# Altium schematic sheet P2.schdoc
size 420 x 298 mm; Symbol: Sheet-Symbol_A3; Company: 嘉立创EDA; Version: V1.0; Page Size: A3; @Project Name: ESP32S3_DMX_RDM_2026-06-09; @Page Count: 2; @Update Date: 2026-08-19; @Create Date: 2026-08-19; @Schematic Name: Schematic_BAT; @Page No: 2; @Page Name: P2; Device: Sheet-Symbol_A3
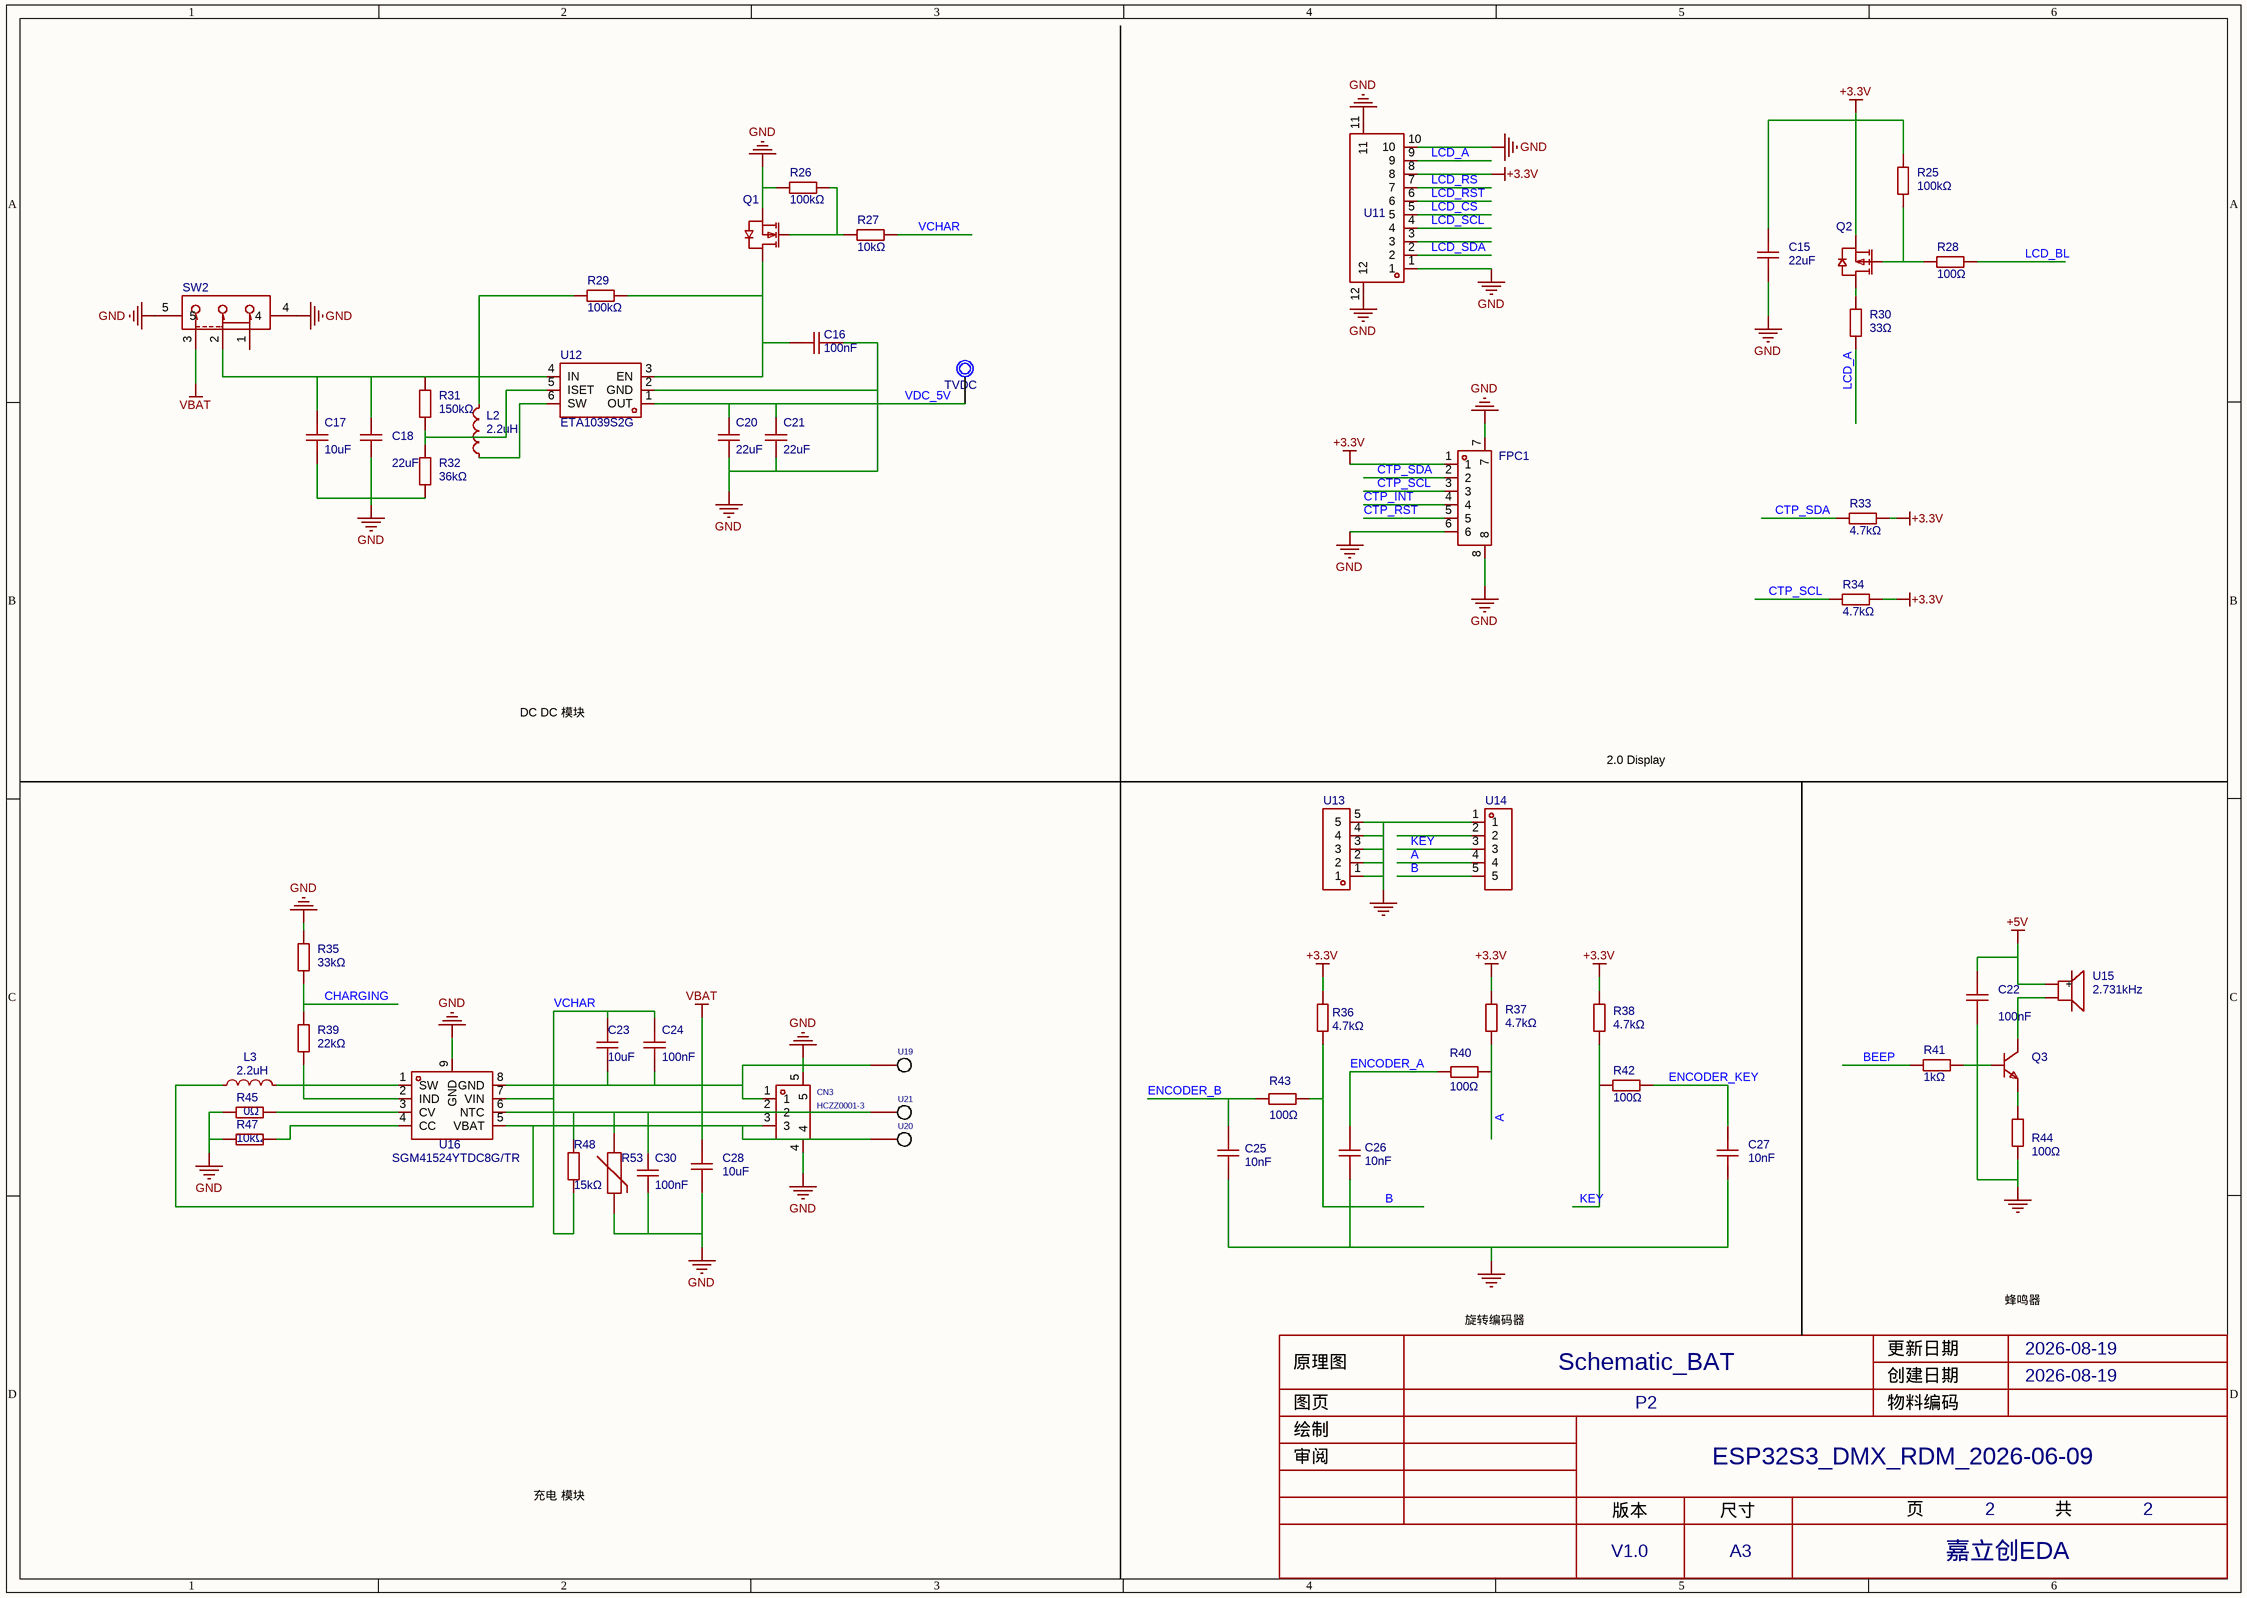
[diagram p0: P2.schdoc]

## Parts
C15  22uF  [C0805]
C16  100nF  [C0805]
C17  10uF  [C0805]
C18  22uF  [C0805]
C20  22uF  [C0805]
C21  22uF  [C0805]
C22  100nF  [C0805]
C23  10uF  [C0805]
C24  100nF  [C0805]
C25  10nF  [C0805]
C26  10nF  [C0805]
C27  10nF  [C0805]
C28  10uF  [C0805]
C30  100nF  [C0603]
CN3  HCZZ0001-3  [CONN-SMD_3P-P1.25_HCZZ0001-3]
FPC1  05B20L06P  [FPC-SMD_6P-P0.50_05B20L06P]  (value not drawn)
L2  2.2uH  [IND-SMD_L4.0-W4.0]
L3  2.2uH  [IND-SMD_L4.0-W4.0]
Q1  NTR4503NT1G  [SOT-23-3_L2.9-W1.3-P1.90-LS2.4-BR]  (value not drawn)
Q2  AO3401A  [SOT-23-3_L2.9-W1.3-P1.90-LS2.4-BR]  (value not drawn)
Q3  S8050  [SOT-23-3_L2.9-W1.3-P1.90-LS2.4-BR]  (value not drawn)
R25  100kΩ  [R0805]
R26  100kΩ  [R0805]
R27  10kΩ  [R0805]
R28  100Ω  [R0805]
R29  100kΩ  [R0805]
R30  33Ω  [R0805]
R31  150kΩ  [R0805]
R32  36kΩ  [R0805]
R33  4.7kΩ  [R0805]
R34  4.7kΩ  [R0805]
R35  33kΩ  [R0805]
R36  4.7kΩ  [R0805]
R37  4.7kΩ  [R0805]
R38  4.7kΩ  [R0805]
R39  22kΩ  [R0805]
R40  100Ω  [R0805]
R41  1kΩ  [R0805]
R42  100Ω  [R0805]
R43  100Ω  [R0805]
R44  100Ω  [R0805]
R45  0Ω  [R0805]
R47  10kΩ  [R0805]
R48  15kΩ  [R0805]
R53  SDNT1608X103F3950FTF  [R0603]  (value not drawn)
SW2  SK-12D02-G030  [SW-TH_SK-12D02VG3]  (value not drawn)
TVDC  (no value)  [测试点]
U11  HC-FPC-0.5-10P-CSH20  [FPC-SMD_10P-P0.50_HC-FPC-0.5-10P-CSH20]  (value not drawn)
U12  ETA1039S2G  [SOT-23-6_L2.9-W1.6-P0.95-LS2.8-BR]
U13  2541WV-05P  [HDR-TH_5P-P2.54-V-M]  (value not drawn)
U14  2541WV-05P  [HDR-TH_5P-P2.54-V-M]  (value not drawn)
U15  2.731kHz  [BUZ-SMD_4P-L8.5-W8.5-P8.50-TL-A]
U16  SGM41524YTDC8G/TR  [DFN-8_L3.0-W2.0-P0.50-TL-EP-1]
U19  电池焊盘  [电池焊盘]  (value not drawn)
U20  电池焊盘  [电池焊盘]  (value not drawn)
U21  电池焊盘  [电池焊盘]  (value not drawn)

## Nets
+3.3V: C15.2 FPC1.1 Q2.2(S) R25.2 R33.2 R34.2 R36.2 R37.2 R38.2 U11.8
+5V: C22.2 U15.1(+)
GND: C15.1 C16.1 C17.2 C18.2 C20.2 C21.2 C22.1 C23.2 C24.1 C25.1 C26.1 C27.1 C28.2 C30.1 CN3.1 CN3.4 CN3.5 FPC1.6 FPC1.7 FPC1.8 Q1.2(S) R26.2 R32.1 R35.2 R44.1 R45.2 R47.2 R53.1 SW2.4 SW2.5 U11.1 U11.10 U11.11 U11.12 U12.2(GND) U13.1 U13.2 U13.3 U13.4 U13.5 U14.1 U16.8(GND) U16.9(GND) U19.1
VBAT: C28.1 CN3.3 L3.1 SW2.3 U16.5(VBAT) U20.1
A: R37.1 R40.2 U14.4
B: R36.1 R43.2 U14.5
BEEP: R41.1
CHARGING: R35.1 R39.2
CTP_INT: FPC1.4
CTP_RST: FPC1.5
CTP_SCL: FPC1.3 R34.1
CTP_SDA: FPC1.2 R33.1
ENCODER_A: C26.2 R40.1
ENCODER_B: C25.2 R43.1
ENCODER_KEY: C27.2 R42.2
KEY: R38.1 R42.1 U14.3
LCD_A: R30.1 U11.9
LCD_BL: R28.1
LCD_CS: U11.5
LCD_RS: U11.7
LCD_RST: U11.6
LCD_SCL: U11.4
LCD_SDA: U11.2
VCHAR: C23.1 C24.2 R27.1 R48.1 U16.7(VIN)
VDC_5V: C20.1 C21.1 TVDC.1 U12.1(OUT)
NetC16_2: C16.2 Q1.3(D) R29.2 U12.3(EN)
NetC17_1: C17.1 C18.1 L2.2 R29.1 R31.2 SW2.2 U12.4(IN)
NetC30_2: C30.2 CN3.2 R48.2 R53.2 U16.6(NTC) U21.1
NetL2_1: L2.1 U12.6(SW)
NetL3_2: L3.2 U16.1(SW)
NetQ1_1: Q1.1(G) R26.1 R27.2
NetQ2_1: Q2.1(G) R25.1 R28.2
NetQ2_3: Q2.3(D) R30.2
NetQ3_1: Q3.1(B) R41.2
NetQ3_2: Q3.2(E) R44.2
NetQ3_3: Q3.3(C) U15.2
NetR31_1: R31.1 R32.2 U12.5(ISET)
NetR39_1: R39.1 U16.2(IND)
NetR45_1: R45.1 U16.3(CV)
NetR47_1: R47.1 U16.4(CC)

Not connected (* = marked no-connect by the designer): SW2 1; U11 3; U14 2; U15 3 4

## Notes on the sheet
- DC DC 模块
- 2.0 Display
- 旋转编码器
- 蜂鸣器
- 充电 模块
- 更新日期
- 2026-08-19
- 原理图
- 图页
- Schematic_BAT
- P2
- 创建日期
- 物料编码
- 审阅
- 绘制
- ESP32S3_DMX_RDM_2026-06-09
- 版本
- V1.0
- 尺寸
- A3
- 页
- 2
- 嘉立创EDA
- 共

## Library data of the parts
C15 = GRM21BR61A226ME51K: Manufacturer: muRata(村田); Add into BOM: yes; 3D Model: 1ba041120af144c991958decab20d2410819f05c4eef4c71ace90d822a990e87; 3D Model Transform: 78.74,51.181,0,0,0,0,0,0.0005,0; ModelName: C0805_L2.0-W1.3-H1.3; Symbol: GRM21BR61A226ME51K; Device: GRM21BR61A226ME51K; Convert to PCB: yes; Manufacturer Part: GRM21BR61A226ME51K; Supplier: LCSC; Supplier Part: GRM21BR61A226ME51K.1; Value: 22uF; FootprintName: C0805
C16 C22 C24 = CC0805KRX7R9BB104: 容值:100nF;精度:±10%;额定电压:50V;温度系数:X7R;; Manufacturer: YAGEO(国巨); Add into BOM: yes; Tolerance: ±10%; Voltage Rating: 50V; Temperature Coefficient: X7R; 3D Model: 1ba041120af144c991958decab20d241; 3D Model Transform: 78.74,51.181,0,0,0,0,0,0.0005,0; ModelName: C0805_L2.0-W1.3-H1.3; Symbol: CC0805KRX7R9BB104; Device: CC0805KRX7R9BB104; Convert to PCB: yes; LCSC Part Name: 100nF ±10% 50V; Supplier Part: C49678; Manufacturer Part: CC0805KRX7R9BB104; Supplier Footprint: 0805; JLCPCB Part Class: Basic Part; Datasheet: https://item.szlcsc.com/datasheet/CC0805KRX7R9BB104/50686.html; Supplier: LCSC; Value: 100nF; FootprintName: C0805
C17 C23 C28 = GRM21BR61H106KE43L: 容值:10uF;精度:±10%;额定电压:50V;温度系数:X5R;; Manufacturer: muRata(村田); 3D Model: 1ba041120af144c991958decab20d2410819f05c4eef4c71ace90d822a990e87; 3D Model Transform: 78.74,51.181,0,0,0,0,0,0.0005,0; Tolerance: ±10%; Voltage Rating: 50V; Temperature Coefficient: X5R; AddInBom: yes; ModelName: C0805_L2.0-W1.3-H1.3; Symbol: GRM21BR61H106KE43L; Device: GRM21BR61H106KE43L; LCSC Part Name: 10uF ±10% 50V; Supplier Part: C440198; Manufacturer Part: GRM21BR61H106KE43L; Supplier Footprint: 0805; JLCPCB Part Class: Basic Part; Datasheet: https://item.szlcsc.com/datasheet/GRM21BR61H106KE43L/439567.html; Supplier: LCSC; Value: 10uF; ConvertToPcb: yes; FootprintName: C0805
C18 = GRM21BR61E226ME44L: 容值:22uF;精度:±20%;额定电压:25V;温度系数:X5R;; Manufacturer: muRata(村田); Add into BOM: yes; Tolerance: ±20%; Voltage Rating: 25V; Temperature Coefficient: X5R; 3D Model: 1ba041120af144c991958decab20d241; 3D Model Transform: 78.74,51.181,0,0,0,0,0,0.0005,0; ModelName: C0805_L2.0-W1.3-H1.3; Symbol: GRM21BR61E226ME44L; Device: GRM21BR61E226ME44L; Convert to PCB: yes; LCSC Part Name: 22uF ±20% 25V; Supplier Part: C86816; Manufacturer Part: GRM21BR61E226ME44L; Supplier Footprint: 0805; JLCPCB Part Class: Extended Part; Datasheet: https://item.szlcsc.com/datasheet/GRM21BR61E226ME44L/87993.html; Supplier: LCSC; Value: 22uF; FootprintName: C0805
C20 C21 = GRM21BR61E226ME44L: 容值:22uF;精度:±20%;额定电压:25V;温度系数:X5R;; Manufacturer: muRata(村田); Add into BOM: yes; Tolerance: ±20%; Voltage Rating: 25V; Temperature Coefficient: X5R; 3D Model: 1ba041120af144c991958decab20d2410819f05c4eef4c71ace90d822a990e87; 3D Model Transform: 78.74,51.181,0,0,0,0,0,0.0005,0; ModelName: C0805_L2.0-W1.3-H1.3; Symbol: GRM21BR61E226ME44L; Device: GRM21BR61E226ME44L; Convert to PCB: yes; LCSC Part Name: 22uF ±20% 25V; Supplier Part: C86816; Manufacturer Part: GRM21BR61E226ME44L; Supplier Footprint: 0805; JLCPCB Part Class: Extended Part; Datasheet: https://item.szlcsc.com/datasheet/GRM21BR61E226ME44L/87993.html; Supplier: LCSC; Value: 22uF; FootprintName: C0805
C25-C27 = CC0805MRX7R9BB103: 容值:10nF;精度:±20%;额定电压:50V;温度系数:X7R;; Manufacturer: YAGEO(国巨); Add into BOM: yes; 3D Model: 1ba041120af144c991958decab20d241; 3D Model Transform: 78.74,51.181,0,0,0,0,0,0.0005,0; Tolerance: ±20%; Temperature Coefficient: X7R; Voltage Rating: 50V; ModelName: C0805_L2.0-W1.3-H1.3; Symbol: CC0805MRX7R9BB103; Device: CC0805MRX7R9BB103; Convert to PCB: yes; LCSC Part Name: 10nF ±20% 50V; Supplier Part: C2169410; Manufacturer Part: CC0805MRX7R9BB103; Supplier Footprint: 0805; JLCPCB Part Class: Extended Part; Datasheet: https://item.szlcsc.com/datasheet/CC0805MRX7R9BB103/2261475.html; Supplier: LCSC; Value: 10nF; FootprintName: C0805
C30 = CL10B104KO8NNNC: 容值:100nF;精度:±10%;额定电压:16V;温度系数:X7R;; Manufacturer: SAMSUNG(三星); AddInBom: yes; ModelId: ac125912035d415993ca9572d50418b10819f05c4eef4c71ace90d822a990e87; ModelName: C0603_L1.6-W0.8-H0.8; ModelTransform: 62.992,31.496,0,0,0,0,0,0,0; Tolerance: ±10%; Voltage Rating: 16V; Temperature Coefficient: X7R; Symbol: CL10B104KO8NNNC; Device: CL10B104KO8NNNC; LCSC Part Name: 100nF ±10% 16V; SupplierPart: C66501; ManufacturerPart: CL10B104KO8NNNC; Supplier Footprint: 0603; JLCPCB Part Class: Extended Part; Datasheet: https://item.szlcsc.com/datasheet/CL10B104KO8NNNC/67585.html; Supplier: LCSC; ConvertToPcb: yes; FootprintName: C0603; Value: 100nF
CN3 = HCZZ0001-3: 插针结构:1x3P;间距:1.25mm;安装方式:卧贴;参考系列:PicoBlade(MX 1.25);总PIN数:3P;排数:1;每排PIN数:3;行距:-;额定电流:1A;触头材质:铜;触头镀层:锡;工作温度:-25℃~+70℃;; Manufacturer: HC(虹成电子); Add into BOM: yes; Pins Structure: 1x3P; Pitch: 1.25mm; Number of PINs Per Row: 3; Current Rating: 1A; Voltage Rating: 125V; Plastic Material: LCP; Z-Height of the Board: 3.6mm; X-Length of Bottom Edge on Board (Spacing Line): 8.85mm; Y-Width of Bottom Edge on Board: 5.4mm; 3D Model: c6a9bdedfd694ef4ab9e0380057e79cd; 3D Model Transform: 348.8182,212.598,0,0,0,0,0,-39.685,0; Symbol: HCZZ0001-3; Device: HCZZ0001-3; Convert to PCB: yes; LCSC Part Name: 米色 1x3P 间距:1.25mm 卧贴 系列:PicoBlade(MX 1.25); Supplier Part: C7433454; Manufacturer Part: HCZZ0001-3; Supplier Footprint: SMD,P=1.25mm,卧贴; JLCPCB Part Class: Extended Part; Datasheet: https://item.szlcsc.com/datasheet/HCZZ0001-3/8442479.html; Supplier: LCSC; Mounting Type: 卧贴; Reference Series: PicoBlade(MX 1.25); Number of Pins: 3P; Number of Rows: 1; Row Spacing: -; Contact Material: 铜; Contact Plating: 锡; Operating Temperature: -25℃~+70℃; Flame Retardant Rating: -; Color: 米色; Supplementary Features: -; FootprintName: CONN-SMD_3P-P1.25_HCZZ0001-3; ModelName: CONN-SMD_3P-P1.25_HCZZ0001-3
FPC1 = 05B20L06P: 锁定特性:抽屉式;触点类型:下接;触点数量:6P;间距:0.5mm;; Manufacturer: HanElectricity(瀚源); 3D Model: 3af2045d771d4a89add03d0759047a010819f05c4eef4c71ace90d822a990e87; 3D Model Transform: 337.4009,204.724,0,180,0,0,-0.002,47.68,0; Locking Feature: 抽屉式; Number of Contacts: 6P; Pitch: 0.5mm; AddInBom: yes; Symbol: 05B20L06P; Device: 05B20L06P; LCSC Part Name: 抽屉式 下接 P数:6P 间距:0.5mm; Supplier Part: C22435651; Manufacturer Part: 05B20L06P; Supplier Footprint: SMD,P=0.5mm,卧贴; JLCPCB Part Class: Extended Part; Datasheet: https://item.szlcsc.com/datasheet/05B20L06P/24065925.html; Supplier: LCSC; Contact Type: 下接; Height Above Board: 2mm; Contact Plating: 锡; ConvertToPcb: yes; FootprintName: FPC-SMD_6P-P0.50_05B20L06P; ModelName: FPC-SMD_6P-P0.50_05B20L06P
L2 = SWPA4030S2R2NT: 电感值:2.2uH;精度:±30%;额定电流:2.95A;饱和电流(Isat):5.8A;类型:-;; Manufacturer: Sunlord(顺络); AddInBom: yes; ModelId: 45bc3737ecfd4f3bb122605ee525b0180819f05c4eef4c71ace90d822a990e87; ModelName: IND-SMD_L4.0-W4.0-H1.9; ModelTransform: 157.48,157.484,0,0,0,0,0,0,0; Tolerance: ±30%; Current Rating: 2.95A; Current - Saturation(Isat): 5.8A; DC Resistance(DCR): 30mΩ; Symbol: SWPA4030S2R2NT; Device: SWPA4030S2R2NT; LCSC Part Name: 2.2uH ±30% 5.8A; SupplierPart: C279948; ManufacturerPart: SWPA4030S2R2NT; Supplier Footprint: SMD,4x4mm; JLCPCB Part Class: Extended Part; Datasheet: https://item.szlcsc.com/datasheet/SWPA4030S2R2NT/266524.html; Supplier: LCSC; ConvertToPcb: yes; FootprintName: IND-SMD_L4.0-W4.0; Value: 2.2uH; Type: -; Ratings: -
L3 = WPN4020H2R2MT: 电感值:2.2uH;精度:±20%;额定电流:4.3A;饱和电流(Isat):7.6A;类型:-;; Manufacturer: Sunlord(顺络); AddInBom: yes; ModelId: 45bc3737ecfd4f3bb122605ee525b0180819f05c4eef4c71ace90d822a990e87; ModelName: IND-SMD_L4.0-W4.0-H1.9; ModelTransform: 157.48,157.484,0,0,0,0,0,0,0; Tolerance: ±20%; Current Rating: 4.3A; Current - Saturation(Isat): 7.6A; DC Resistance(DCR): 48mΩ; Symbol: WPN4020H2R2MT; Device: WPN4020H2R2MT; LCSC Part Name: 2.2uH ±20% 7.6A; SupplierPart: C98361; ManufacturerPart: WPN4020H2R2MT; Supplier Footprint: SMD,4x4mm; JLCPCB Part Class: Extended Part; Datasheet: https://item.szlcsc.com/datasheet/WPN4020H2R2MT/99570.html; Supplier: LCSC; ConvertToPcb: yes; FootprintName: IND-SMD_L4.0-W4.0; Value: 2.2uH; Type: -; Ratings: -
Q1 = NTR4503NT1G_C19829404: 漏源电压(Vdss):30V;连续漏极电流(Id):3A;导通电阻(RDS(on)):95mΩ@4.5V;耗散功率(Pd):900mW;阈值电压(Vgs(th)):3V@250uA;; Manufacturer: TECH PUBLIC(台舟); 3D Model: c62791f0466c4ae2a892c056b845b0ca0819f05c4eef4c71ace90d822a990e87; 3D Model Transform: 98.425,114.173,0,180,0,0,0.0005,-0.0005,0; Drain to Source Voltage: 30V; Current - Continuous Drain(Id): 3A; Pd - Power Dissipation: 900mW; Gate Charge(Qg): 10nC@10V; Input Capacitance(Ciss): 235pF; Reverse Transfer Capacitance (Crss@Vds): 18pF; Output Capacitance(Coss): 35pF; AddInBom: yes; ModelName: SOT-23-3P_L2.9-W1.3-H1.0-LS2.4-P0.95; Symbol: NTR4503NT1G_C19829404; Device: NTR4503NT1G_C19829404; LCSC Part Name: 耐压:30V 电流:3A; Supplier Part: C19829404; Manufacturer Part: NTR4503NT1G; Supplier Footprint: SOT-23; JLCPCB Part Class: Extended Part; Datasheet: https://item.szlcsc.com/datasheet/NTR4503NT1G/21156699.html; Supplier: LCSC; RDS(on): 95mΩ@4.5V; Gate Threshold Voltage (Vgs(th)): 3V@250uA; Operating Temperature: -55℃~+150℃; ConvertToPcb: yes; FootprintName: SOT-23-3_L2.9-W1.3-P1.90-LS2.4-BR
Q2 = AO3401A: 漏源电压(Vdss):30V;连续漏极电流(Id):4.2A;导通电阻(RDS(on)):55mΩ@10V,4.2A;耗散功率(Pd):1.2W;阈值电压(Vgs(th)):-;; Manufacturer: TECH PUBLIC(台舟); Symbol: AO3401A_C5122001; Add into BOM: yes; 3D Model: c62791f0466c4ae2a892c056b845b0ca; 3D Model Transform: 98.425,114.173,0,180,0,0,0.0005,-0.0005,0; Drain to Source Voltage: 30V; Pd - Power Dissipation: 1.2W; Gate Charge(Qg): 8.5nC; Input Capacitance(Ciss): 880pF@15V; Reverse Transfer Capacitance (Crss@Vds): 65pF@15V; ModelName: SOT-23-3P_L2.9-W1.3-H1.0-LS2.4-P0.95; Device: AO3401A; Convert to PCB: yes; LCSC Part Name: 耐压:30V 电流:4.2A; Supplier Part: C5122001; Manufacturer Part: AO3401A; Supplier Footprint: SOT-23; JLCPCB Part Class: Extended Part; Datasheet: https://item.szlcsc.com/datasheet/AO3401A/5710587.html; Supplier: LCSC; Current - Continuous Drain(Id): 4.2A; RDS(on): 55mΩ@10V,4.2A; Gate Threshold Voltage (Vgs(th)): -; Operating Temperature: -55℃~+150℃; FootprintName: SOT-23-3_L2.9-W1.3-P1.90-LS2.4-BR
Q3 = S8050_C916390: 晶体管类型:-;集电极电流(Ic):500mA;集射极击穿电压(Vceo):25V;耗散功率(Pd):300mW;; Manufacturer: JSMSEMI(杰盛微); Add into BOM: yes; 3D Model: c62791f0466c4ae2a892c056b845b0ca; 3D Model Transform: 98.425,114.173,0,180,0,0,0.0005,-0.0005,0; Current - Collector(Ic): 500mA; Collector - Emitter Voltage VCEO: 25V; Pd - Power Dissipation: 300mW; Transition frequency(fT): 150MHz; Current - Collector Cutoff: 100nA; Vce Saturation(VCE(sat)): 600mV; Emitter-Base Voltage(Vebo): 5V; Number: 1个NPN; Configuration: 独立式; ModelName: SOT-23-3P_L2.9-W1.3-H1.0-LS2.4-P0.95; Symbol: S8050; Device: S8050_C916390; Convert to PCB: yes; LCSC Part Name: 电流:500mA 电压:25V; Supplier Part: C916390; Manufacturer Part: S8050; Supplier Footprint: SOT-23; JLCPCB Part Class: Extended Part; Datasheet: https://item.szlcsc.com/datasheet/S8050/990886.html; Supplier: LCSC; Operating Temperature: -; type: -; FootprintName: SOT-23-3_L2.9-W1.3-P1.90-LS2.4-BR
R25 R26 R29 = RC0805JR-07100KL: 电阻类型:厚膜电阻;阻值:100kΩ;精度:±5%;功率:125mW;工作电压:150V;温度系数:±100ppm/℃;; Manufacturer: YAGEO(国巨); Add into BOM: yes; 3D Model: 37a81e68749a4138bd2dfa6897b24b85; 3D Model Transform: 78.74,51.181,0,0,0,0,0,-0.0005,0; Tolerance: ±5%; Power(Watts): 125mW; Voltage-Supply(Max): 150V; ModelName: R0805_L2.0-W1.3-H0.6; Symbol: RC0805JR-07100KL; Device: RC0805JR-07100KL; Convert to PCB: yes; Value: 100kΩ; Supplier Footprint: 0805; LCSC Part Name: 厚膜电阻 100kΩ ±5% 125mW; Supplier Part: C100049; Manufacturer Part: RC0805JR-07100KL; JLCPCB Part Class: Extended Part; Datasheet: https://item.szlcsc.com/datasheet/RC0805JR-07100KL/101263.html; Supplier: LCSC; Type: 厚膜电阻; Temperature Coefficient: ±100ppm/℃; Operating Temperature: -55℃~+155℃; FootprintName: R0805
R27 = RC0805JR-0710KL: 电阻类型:厚膜电阻;阻值:10kΩ;精度:±5%;功率:125mW;最大工作电压:150V;温度系数:±100ppm/℃;; Manufacturer: YAGEO(国巨); Add into BOM: yes; Tolerance: ±5%; Power(Watts): 125mW; 3D Model: 37a81e68749a4138bd2dfa6897b24b85; 3D Model Transform: 78.74,51.181,0,0,0,0,0,-0.0005,0; Overload Voltage (Max): 150V; ModelName: R0805_L2.0-W1.3-H0.6; Symbol: RC0805JR-0710KL; Device: RC0805JR-0710KL; Convert to PCB: yes; LCSC Part Name: 厚膜电阻 10kΩ ±5% 125mW; Supplier Part: C100047; Manufacturer Part: RC0805JR-0710KL; Supplier Footprint: 0805; JLCPCB Part Class: Extended Part; Datasheet: https://atta.szlcsc.com/upload/public/pdf/source/20170708/1499509500945.pdf; Supplier: LCSC; Type: 厚膜电阻; Value: 10kΩ; Temperature Coefficient: ±100ppm/℃; Operating Temperature Range: -55℃~+155℃; FootprintName: R0805
R28 R40 R42-R44 = RC0805FR-07100RL: 电阻类型:厚膜电阻;阻值:100Ω;精度:±1%;功率:125mW;工作电压:150V;温度系数:±100ppm/℃;; Manufacturer: YAGEO(国巨); Add into BOM: yes; 3D Model: 37a81e68749a4138bd2dfa6897b24b85; 3D Model Transform: 78.74,51.181,0,0,0,0,0,-0.0005,0; Tolerance: ±1%; Power(Watts): 125mW; Voltage-Supply(Max): 150V; ModelName: R0805_L2.0-W1.3-H0.6; Symbol: RC0805FR-07100RL; Device: RC0805FR-07100RL; Convert to PCB: yes; LCSC Part Name: 厚膜电阻 100Ω ±1% 125mW; Supplier Part: C105577; Manufacturer Part: RC0805FR-07100RL; Supplier Footprint: 0805; JLCPCB Part Class: Extended Part; Datasheet: https://item.szlcsc.com/datasheet/RC0805FR-07100RL/106792.html; Supplier: LCSC; Type: 厚膜电阻; Value: 100Ω; Temperature Coefficient: ±100ppm/℃; Operating Temperature: -55℃~+155℃; FootprintName: R0805
R30 = RC0805FR-0733RL: 电阻类型:厚膜电阻;阻值:33Ω;精度:±1%;功率:125mW;工作电压:150V;温度系数:±100ppm/℃;; Manufacturer: YAGEO(国巨); Add into BOM: yes; 3D Model: 37a81e68749a4138bd2dfa6897b24b85; 3D Model Transform: 78.74,51.181,0,0,0,0,0,-0.0005,0; Tolerance: ±1%; Power(Watts): 125mW; Voltage-Supply(Max): 150V; ModelName: R0805_L2.0-W1.3-H0.6; Symbol: RC0805FR-0733RL; Device: RC0805FR-0733RL; Convert to PCB: yes; LCSC Part Name: 厚膜电阻 33Ω ±1% 125mW; Supplier Part: C126353; Manufacturer Part: RC0805FR-0733RL; Supplier Footprint: 0805; JLCPCB Part Class: Extended Part; Datasheet: https://item.szlcsc.com/datasheet/RC0805FR-0733RL/137633.html; Supplier: LCSC; Type: 厚膜电阻; Value: 33Ω; Temperature Coefficient: ±100ppm/℃; Operating Temperature: -55℃~+155℃; FootprintName: R0805
R31 = RC0805FR-07150KL: 电阻类型:厚膜电阻;阻值:150kΩ;精度:±1%;功率:125mW;工作电压:150V;温度系数:±100ppm/℃;; Manufacturer: YAGEO(国巨); AddInBom: yes; ModelId: 37a81e68749a4138bd2dfa6897b24b850819f05c4eef4c71ace90d822a990e87; ModelName: R0805_L2.0-W1.3-H0.6; ModelTransform: 78.74,51.181,0,0,0,0,0,-0.0005,0; Tolerance: ±1%; Power(Watts): 125mW; Voltage-Supply(Max): 150V; Symbol: RC0805FR-07150KL; Device: RC0805FR-07150KL; LCSC Part Name: 厚膜电阻 150kΩ ±1% 125mW; SupplierPart: C114558; ManufacturerPart: RC0805FR-07150KL; Supplier Footprint: 0805; JLCPCB Part Class: Extended Part; Datasheet: https://item.szlcsc.com/datasheet/RC0805FR-07150KL/115802.html; Supplier: LCSC; ConvertToPcb: yes; FootprintName: R0805; Type: 厚膜电阻; Value: 150kΩ; Temperature Coefficient: ±100ppm/℃; Operating Temperature: -55℃~+155℃
R32 = RC0805FR-0736KL: 电阻类型:厚膜电阻;阻值:36kΩ;精度:±1%;功率:125mW;工作电压:150V;温度系数:±100ppm/℃;; Manufacturer: YAGEO(国巨); Add into BOM: yes; 3D Model: 37a81e68749a4138bd2dfa6897b24b85; 3D Model Transform: 78.74,51.181,0,0,0,0,0,-0.0005,0; Tolerance: ±1%; Power(Watts): 125mW; Voltage-Supply(Max): 150V; ModelName: R0805_L2.0-W1.3-H0.6; Symbol: RC0805FR-0736KL; Device: RC0805FR-0736KL; Convert to PCB: yes; LCSC Part Name: 厚膜电阻 36kΩ ±1% 125mW; Supplier Part: C114527; Manufacturer Part: RC0805FR-0736KL; Supplier Footprint: 0805; JLCPCB Part Class: Extended Part; Datasheet: https://item.szlcsc.com/datasheet/RC0805FR-0736KL/115771.html; Supplier: LCSC; Type: 厚膜电阻; Value: 36kΩ; Temperature Coefficient: ±100ppm/℃; Operating Temperature: -55℃~+155℃; FootprintName: R0805
R33 R34 R36-R38 = RC0805JR-074K7L: 电阻类型:厚膜电阻;阻值:4.7kΩ;精度:±5%;功率:125mW;工作电压:150V;温度系数:±100ppm/℃;; Manufacturer: YAGEO(国巨); Add into BOM: yes; 3D Model: 37a81e68749a4138bd2dfa6897b24b85; 3D Model Transform: 78.74,51.181,0,0,0,0,0,-0.0005,0; Tolerance: ±5%; Power(Watts): 125mW; Voltage-Supply(Max): 150V; ModelName: R0805_L2.0-W1.3-H0.6; Symbol: RC0805JR-074K7L; Device: RC0805JR-074K7L; Convert to PCB: yes; LCSC Part Name: 厚膜电阻 4.7kΩ ±5% 125mW; Supplier Part: C105427; Manufacturer Part: RC0805JR-074K7L; Supplier Footprint: 0805; JLCPCB Part Class: Extended Part; Datasheet: https://item.szlcsc.com/datasheet/RC0805JR-074K7L/106642.html; Supplier: LCSC; Type: 厚膜电阻; Value: 4.7kΩ; Temperature Coefficient: ±100ppm/℃; Operating Temperature: -55℃~+155℃; FootprintName: R0805
R35 = AC0805FR-0733KL: 电阻类型:厚膜电阻;阻值:33kΩ;精度:±1%;功率:125mW;最大工作电压:150V;温度系数:±100ppm/℃;; Manufacturer: YAGEO(国巨); Add into BOM: yes; Tolerance: ±1%; Power(Watts): 125mW; 3D Model: 37a81e68749a4138bd2dfa6897b24b85; 3D Model Transform: 78.74,51.181,0,0,0,0,0,-0.0005,0; Overload Voltage (Max): 150V; ModelName: R0805_L2.0-W1.3-H0.6; Symbol: AC0805FR-0733KL; Device: AC0805FR-0733KL; Convert to PCB: yes; Manufacturer Part: AC0805FR-0733KL; Supplier: LCSC; Supplier Part: C144563; LCSC Part Name: 厚膜电阻 33kΩ ±1% 125mW; Supplier Footprint: 0805; JLCPCB Part Class: Extended Part; Datasheet: https://atta.szlcsc.com/upload/public/pdf/source/20180927/C229861_4ABDC471507C1ED6AFB4BA66AFC8620A.pdf; Type: 厚膜电阻; Value: 33kΩ; Temperature Coefficient: ±100ppm/℃; Operating Temperature Range: -55℃~+155℃; FootprintName: R0805
R39 = AC0805FR-0722KL: 电阻类型:厚膜电阻;阻值:22kΩ;精度:±1%;功率:125mW;工作电压:150V;温度系数:±100ppm/℃;; Manufacturer: YAGEO(国巨); Add into BOM: yes; Tolerance: ±1%; Power(Watts): 125mW; 3D Model: 37a81e68749a4138bd2dfa6897b24b85; 3D Model Transform: 78.74,51.181,0,0,0,0,0,-0.0005,0; Voltage-Supply(Max): 150V; ModelName: R0805_L2.0-W1.3-H0.6; Symbol: AC0805FR-0722KL; Device: AC0805FR-0722KL; Convert to PCB: yes; Manufacturer Part: AC0805FR-0722KL; Supplier: LCSC; Supplier Part: C144574; LCSC Part Name: 厚膜电阻 22kΩ ±1% 125mW; Supplier Footprint: 0805; JLCPCB Part Class: Extended Part; Datasheet: https://item.szlcsc.com/datasheet/AC0805FR-0722KL/155906.html; Type: 厚膜电阻; Value: 22kΩ; Temperature Coefficient: ±100ppm/℃; Operating Temperature: -55℃~+155℃; FootprintName: R0805
R41 = RC0805JR-071KL: 电阻类型:厚膜电阻;阻值:1kΩ;精度:±5%;功率:125mW;最大工作电压:150V;温度系数:±100ppm/℃;; Manufacturer: YAGEO(国巨); Add into BOM: yes; 3D Model: 37a81e68749a4138bd2dfa6897b24b85; 3D Model Transform: 78.74,51.181,0,0,0,0,0,-0.0005,0; Tolerance: ±5%; Power(Watts): 125mW; Overload Voltage (Max): 150V; ModelName: R0805_L2.0-W1.3-H0.6; Symbol: RC0805JR-071KL; Device: RC0805JR-071KL; Convert to PCB: yes; LCSC Part Name: 厚膜电阻 1kΩ ±5% 125mW; Supplier Part: C100046; Manufacturer Part: RC0805JR-071KL; Supplier Footprint: 0805; JLCPCB Part Class: Extended Part; Datasheet: https://atta.szlcsc.com/upload/public/pdf/source/20170708/1499509500945.pdf; Supplier: LCSC; Type: 厚膜电阻; Value: 1kΩ; Temperature Coefficient: ±100ppm/℃; Operating Temperature Range: -55℃~+155℃; FootprintName: R0805
R45 = RC0805FR-070RL: 电阻类型:厚膜电阻;阻值:0Ω;精度:±1%;功率:125mW;工作电压:150V;温度系数:-;; Manufacturer: YAGEO(国巨); Add into BOM: yes; Tolerance: ±1%; Power(Watts): 125mW; 3D Model: 37a81e68749a4138bd2dfa6897b24b85; 3D Model Transform: 78.74,51.181,0,0,0,0,0,-0.0005,0; Voltage-Supply(Max): 150V; ModelName: R0805_L2.0-W1.3-H0.6; Symbol: RC0805FR-070RL; Device: RC0805FR-070RL; Convert to PCB: yes; Manufacturer Part: RC0805FR-070RL; Supplier: LCSC; Supplier Part: C100045; LCSC Part Name: 厚膜电阻 0Ω ±1% 125mW; Supplier Footprint: 0805; JLCPCB Part Class: Extended Part; Datasheet: https://item.szlcsc.com/datasheet/RC0805FR-070RL/101259.html; Type: 厚膜电阻; Value: 0Ω; Temperature Coefficient: -; Operating Temperature: -55℃~+155℃; FootprintName: R0805
R47 = RC0805FR-0710KL: 电阻类型:厚膜电阻;阻值:10kΩ;精度:±1%;功率:125mW;工作电压:150V;温度系数:±100ppm/℃;; Manufacturer: YAGEO(国巨); Add into BOM: yes; Tolerance: ±1%; Power(Watts): 125mW; 3D Model: 37a81e68749a4138bd2dfa6897b24b85; 3D Model Transform: 78.74,51.181,0,0,0,0,0,-0.0005,0; Voltage-Supply(Max): 150V; ModelName: R0805_L2.0-W1.3-H0.6; Symbol: RC0805FR-0710KL; Device: RC0805FR-0710KL; Convert to PCB: yes; Manufacturer Part: RC0805FR-0710KL; Supplier: LCSC; Supplier Part: C84376; LCSC Part Name: 厚膜电阻 10kΩ ±1% 125mW; Supplier Footprint: 0805; JLCPCB Part Class: Extended Part; Datasheet: https://item.szlcsc.com/datasheet/RC0805FR-0710KL/85546.html; Type: 厚膜电阻; Value: 10kΩ; Temperature Coefficient: ±100ppm/℃; Operating Temperature: -55℃~+155℃; FootprintName: R0805
R48 = RC0805FR-0715KL: 电阻类型:厚膜电阻;阻值:15kΩ;精度:±1%;功率:125mW;工作电压:150V;温度系数:±100ppm/℃;; Manufacturer: YAGEO(国巨); Add into BOM: yes; 3D Model: 37a81e68749a4138bd2dfa6897b24b85; 3D Model Transform: 78.74,51.181,0,0,0,0,0,-0.0005,0; Tolerance: ±1%; Power(Watts): 125mW; Voltage-Supply(Max): 150V; ModelName: R0805_L2.0-W1.3-H0.6; Symbol: RC0805FR-0715KL; Device: RC0805FR-0715KL; Convert to PCB: yes; LCSC Part Name: 厚膜电阻 15kΩ ±1% 125mW; Supplier Part: C114559; Manufacturer Part: RC0805FR-0715KL; Supplier Footprint: 0805; JLCPCB Part Class: Extended Part; Datasheet: https://item.szlcsc.com/datasheet/RC0805FR-0715KL/115803.html; Supplier: LCSC; Type: 厚膜电阻; Value: 15kΩ; Temperature Coefficient: ±100ppm/℃; Operating Temperature: -55℃~+155℃; FootprintName: R0805
R53 = SDNT1608X103F3950FTF: 阻值:10kΩ;B值(25℃/50℃):3950K;电阻精度:±1%;功率:100mW;B值精度:±1%;最大稳态电流(25℃):330uA;; Manufacturer: Sunlord(顺络); AddInBom: yes; ModelId: fc143cca1e79419f9cd78b61e9279f080819f05c4eef4c71ace90d822a990e87; ModelTransform: 31.8897,63.7794,0,90,0,0,0,0,0; Resistance @ 25℃: 10kΩ; B Constant (25℃/50℃): 3950K; Resistance Tolerance: ±1%; Power(Watts): 100mW; Steady State Current (Max): 330uA; Dissipation Factor: 1mW/℃; Thermal Time Constant: 5s; Symbol: SDNT1608X103F3950FTF; Device: SDNT1608X103F3950FTF; LCSC Part Name: 10kΩ 3950K 100mW 片式NTC热敏电阻器; SupplierPart: C279936; ManufacturerPart: SDNT1608X103F3950FTF; Supplier Footprint: 0603; JLCPCB Part Class: Extended Part; Datasheet: https://item.szlcsc.com/datasheet/SDNT1608X103F3950FTF/266512.html; Supplier: LCSC; ConvertToPcb: yes; FootprintName: R0603; ModelName: R0603; B Constant (25℃/75℃): -; B Constant (25℃/85℃): -; B Constant (25℃/100℃): -; B Constant Tolerance: ±1%; Operating Temperature: -55℃~+125℃; Length: 1.6mm; Width: 0.8mm; Height: 0.8mm
SW2 = SK-12D02-G030: 电路结构:单刀双掷;安装方式:弯插;开关颜色:黑色;额定电流:1A;额定电压:24V;工作寿命:1万次;; Manufacturer: G-Switch(品赞); Add into BOM: yes; Circuit: 单刀双掷; Actuator Style: 矩形柱状; Switch Height: 7.5mm; 3D Model: 0a55ad0ef3594f23aee1e265f0a55205; Actuator Color: 黑色; Current Rating: 1A; Voltage Rating: 24V; Life: 1万次; Symbol: SK-12D02-G030; Device: SK-12D02-G030; Convert to PCB: yes; LCSC Part Name: 拨动开关SK-12D02 柄高3mm; Supplier Part: C5446808; Manufacturer Part: SK-12D02-G030; Supplier Footprint: 弯插,8.6x4.7mm; JLCPCB Part Class: Extended Part; Datasheet: https://item.szlcsc.com/datasheet/SK-12D02-G030/6342982.html; Supplier: LCSC; Operating Temperature: -25℃~+70℃; Termination Style: PC引脚; Length: 8.6mm; Width: 4.7mm; Mounting Type: 弯插; FootprintName: SW-TH_SK-12D02VG3
TVDC = 测试点: AddInBom: yes; Symbol: 测试点; Device: 测试点; ConvertToPcb: yes; FootprintName: 测试点
U11 = HC-FPC-0.5-10P-CSH20: 锁定特性:抽屉式;触点类型:上接;触点数量:10P;间距:0.5mm;安装方式:卧贴;工作温度:-25℃~+85℃;; Manufacturer: HC(虹成电子); 3D Model: 65ac063f2dfa4293a93b98c2c71f86230819f05c4eef4c71ace90d822a990e87; 3D Model Transform: 417.322,204.724,0,0,0,0,0.005,-45.275,0; Locking Feature: 抽屉式; Number of Contacts: 10P; Pitch: 0.5mm; FFC, FCB Thickness: 0.3mm; AddInBom: yes; Symbol: HC-FPC-0.5-10P-CSH20; Device: HC-FPC-0.5-10P-CSH20; LCSC Part Name: 间距:0.5mm P数:10P 抽屉式 上接; Supplier Part: C19273947; Manufacturer Part: HC-FPC-0.5-10P-CSH20; Supplier Footprint: SMD,P=0.5mm,卧贴; JLCPCB Part Class: Extended Part; Datasheet: https://item.szlcsc.com/datasheet/HC-FPC-0.5-10P-CSH20/20558497.html; Supplier: LCSC; Contact Type: 上接; Mounting Type: 卧贴; Height Above Board: 2mm; Contact Material: 铜; Contact Plating: 锡; Operating Temperature: -25℃~+85℃; ConvertToPcb: yes; FootprintName: FPC-SMD_10P-P0.50_HC-FPC-0.5-10P-CSH20; ModelName: FPC-SMD_10P-P0.50_HC-FPC-0.5-10P-CSH20
U12 = ETA1039S2G: 功能类型:升压型;工作电压:-;输出电压:5V;输出电流:1.5A;输出类型:固定;; Manufacturer: ETA(钰泰); AddInBom: yes; ModelId: 18da8f6c14a34920b3e136b5c401a1190819f05c4eef4c71ace90d822a990e87; ModelName: SOT-23-6_L2.9-W1.6-H1.5-LS2.8-P0.95; ModelTransform: 110.73671,114.173,0,180,0,0,0.001,-0.003,0; Function: 升压型; Output Voltage: 5V; Output Current: 1.5A; Frequency - Switching: 700kHz~1.3MHz; Synchronous Rectifier: 是; Number of Outputs: 1; Topology: 升压式; Quiescent Current: 40uA; Switch tube (built-in/external): 内置; Output Type: 固定; Symbol: ETA1039S2G; Device: ETA1039S2G; LCSC Part Name: 升压型 1.5A; SupplierPart: C42383374; ManufacturerPart: ETA1039S2G; Supplier Footprint: SOT-23-6; JLCPCB Part Class: Extended Part; Datasheet: https://item.szlcsc.com/datasheet/ETA1039S2G/44301760.html; Supplier: LCSC; ConvertToPcb: yes; FootprintName: SOT-23-6_L2.9-W1.6-P0.95-LS2.8-BR; Voltage - Supply: -; Operating Temperature: -40℃~+85℃; Features: 轻载高效模式；可调限流；负载断开；打嗝限流
U13 U14 = 2541WV-05P: 插针结构:1x5P;间距:2.54mm;圆针/方针:方针;安装方式:直插;排数:单排;总PIN位数:5P;配合针长度:6mm;塑高:2.54mm;端接针长度:3mm;触头镀层:金;工作温度:-55℃~+105℃;; Manufacturer: HanElectricity(瀚源); 3D Model: 47d466e4a34f4fc5bc626cf773a24dd5; 3D Model Transform: 499.999,100,0,0,0,0,0,0,-118.11; Pin Structure: 1x5P; Pitch: 2.54mm; Circluar Pins/Square Pins: 方针; AddInBom: yes; ModelName: HDR-TH_5P-P2.54-M-LI-1X5P; Symbol: 2541WV-05P; Device: 2541WV-05P; LCSC Part Name: 1x5P 间距:2.54mm 方针 直插; Supplier Part: C5383114; Manufacturer Part: 2541WV-05P; Supplier Footprint: 插件,P=2.54mm; JLCPCB Part Class: 扩展库; Datasheet: https://item.szlcsc.com/datasheet/2541WV-05P/6258474.html; Supplier: LCSC; Mounting Type: 直插; Number of Rows: 单排; Number of Pins: 5P; Length of Mating Pin: 6mm; Insulation Height: 2.54mm; Length of End Connection Pin: 3mm; Contact Plating: 金; Operating Temperature: -55℃~+105℃; ConvertToPcb: yes; FootprintName: HDR-TH_5P-P2.54-V-M
U15 = HYG-8503A-5027: 频率:2.731kHz;声压(SPL):85dB;; Manufacturer: HYDZ(华宇); Add into BOM: yes; 3D Model: 830c01ddbdaf4dd39115c52bc0b157b2; 3D Model Transform: 334.645,334.645,0,0,0,0,0,0,0; Current Consumption: 90mA; Sound Pressure Level(SPL): 85dB; Symbol: HYG-8503A-5027; Device: HYG-8503A-5027; Convert to PCB: yes; LCSC Part Name: 贴片无源蜂鸣器HYG-8503A-5027 5V; Supplier Part: C18623826; Manufacturer Part: HYG-8503A-5027; Supplier Footprint: SMD; JLCPCB Part Class: Extended Part; Datasheet: https://item.szlcsc.com/datasheet/HYG-8503A-5027/19815519.html; Supplier: LCSC; Value: 2.731kHz; FootprintName: BUZ-SMD_4P-L8.5-W8.5-P8.50-TL-A; ModelName: BUZ-SMD_4P-L8.5-W8.5-P8.50-TL-A
U16 = SGM41524YTDC8G/TR: 工作电压:3.5V~5.5V;最大充电电流:2.3A;电池类型:锂电池;电池节数:1;; Manufacturer: SGMICRO(圣邦微); AddInBom: yes; ModelId: e1f4454fa58a47fd9ad666cc01d6ee450819f05c4eef4c71ace90d822a990e87; ModelTransform: 118.8974,78.74,0,0,0,0,0,0,0; The Chip Type: 充电芯片; Charge Current - Max: 2.3A; Charging Saturation Voltage: 4.2V; Type of Battery: 锂电池; Number of Cells: 1; Battery Temperature Detection: 支持; Supply Current (Iq): 15uA; Symbol: SGM41524YTDC8G/TR; Device: SGM41524YTDC8G/TR; LCSC Part Name: 紧凑型开关式锂/聚合物电池充电器; SupplierPart: C699852; ManufacturerPart: SGM41524YTDC8G/TR; Supplier Footprint: DFN-8-EP(2x3); JLCPCB Part Class: Extended Part; Datasheet: https://item.szlcsc.com/datasheet/SGM41524YTDC8G%252FTR/734526.html; Supplier: LCSC; ConvertToPcb: yes; FootprintName: DFN-8_L3.0-W2.0-P0.50-TL-EP-1; ModelName: DFN-8_L3.0-W2.0-P0.50-TL-EP-1; Voltage - Supply: 3.5V~5.5V; End-Off Voltage: -; Operating Temperature: -40℃~+85℃; 0V Battery Charge: -; Balance Current: -; Interface: -; Features: 恒压充电；恒流充电；自动再充电；充电终止；可编程充电电流；过压保护；涓流充电
U19-U21 = 电池焊盘: Symbol: 电池焊盘; Device: 电池焊盘; FootprintName: 电池焊盘